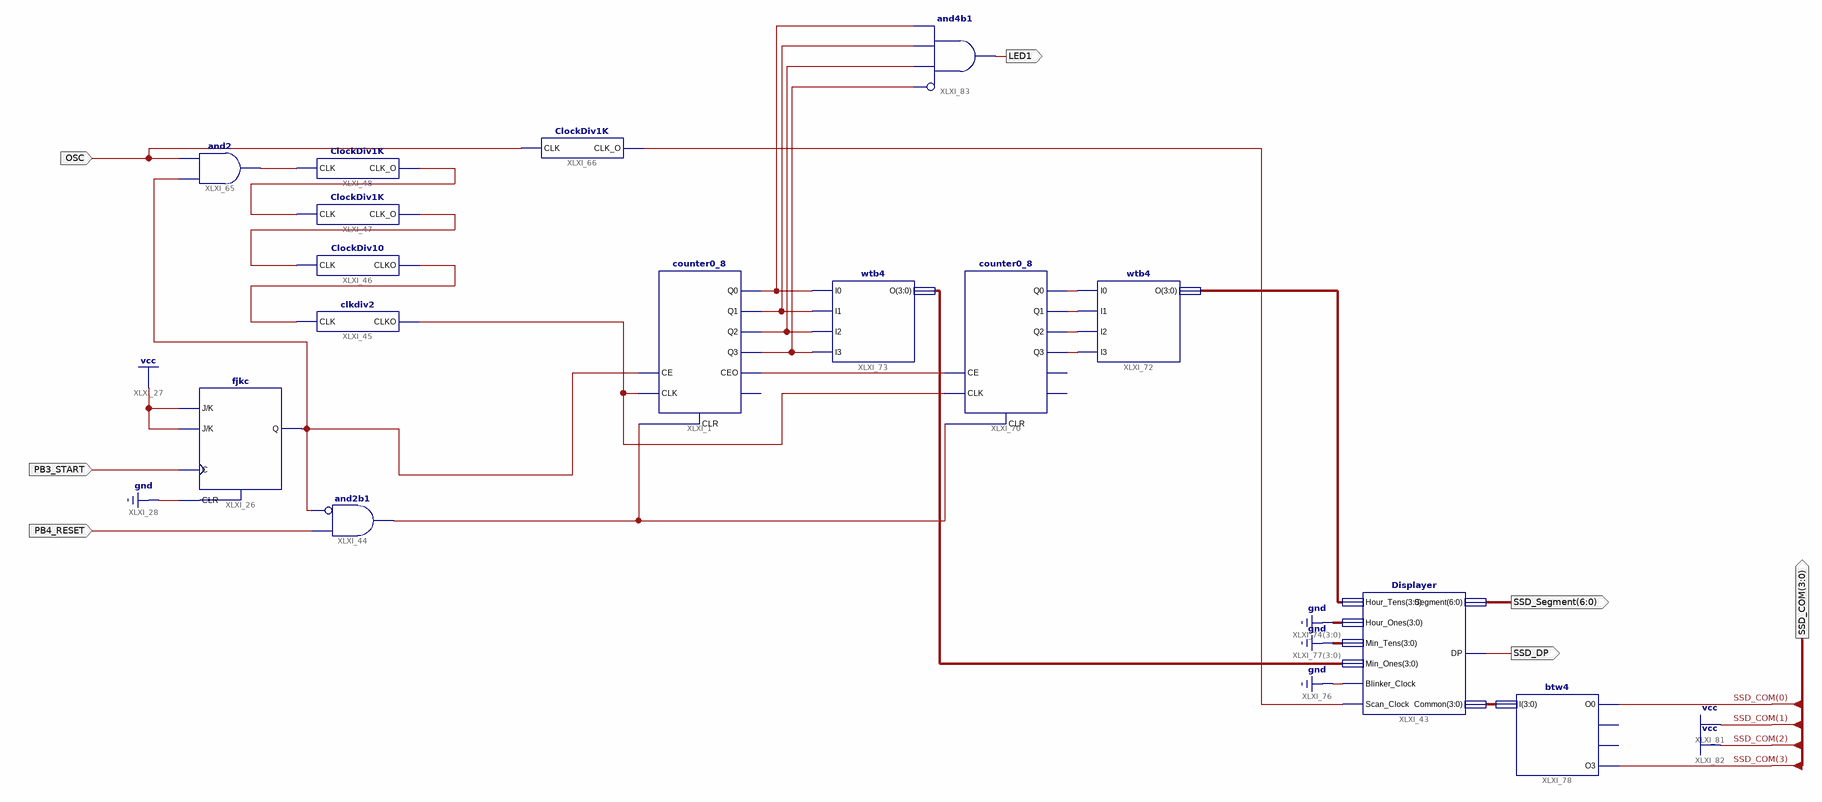
[diagram p0: schematic sheet 1]
// Xilinx ISE schematic mainer.sch (spartan6) as structural Verilog: 15 symbols, 7 ports
module mainer (
  input  PB3_START,
  input  PB4_RESET,
  input  OSC,
  output [6:0] SSD_Segment,
  output SSD_DP,
  output [3:0] SSD_COM,
  output LED1
);

  wire XLXN_42, XLXN_117, XLXN_10793, XLXN_10879, XLXN_10880, XLXN_10881, XLXN_10895, XLXN_10896, XLXN_10899,
       XLXN_10901, XLXN_10902, XLXN_10903, XLXN_10904, XLXN_10923, XLXN_10924, XLXN_10925, XLXN_10926;
  wire [3:0] XLXN_101, XLXN_10911, XLXN_10915;

  counter0_8 XLXI_1 (
    .CE(XLXN_10880), .CLK(XLXN_10895), .CLR(XLXN_10896), .CEO(XLXN_10899), .Q0(XLXN_10923), .Q1(XLXN_10924),
    .Q2(XLXN_10925), .Q3(XLXN_10926));  // open: TC
  fjkc XLXI_26 (.C(PB3_START), .CLR(1'b0), .J(1'b1), .K(1'b1), .Q(XLXN_10880));
  and XLXI_44 (XLXN_10896, ~XLXN_10880, PB4_RESET);  // and2b1
  clkdiv2 XLXI_45 (.CLK(XLXN_10793), .CLKO(XLXN_10895));
  ClockDiv10 XLXI_46 (.CLK(XLXN_42), .CLKO(XLXN_10793));
  ClockDiv1K XLXI_47 (.CLK(XLXN_117), .CLK_O(XLXN_42));
  ClockDiv1K XLXI_48 (.CLK(XLXN_10879), .CLK_O(XLXN_117));
  and XLXI_65 (XLXN_10879, XLXN_10880, OSC);
  ClockDiv1K XLXI_66 (.CLK(OSC), .CLK_O(XLXN_10881));
  Displayer XLXI_43 (
    .Hour_Tens(XLXN_101), .Hour_Ones(4'b0000), .Min_Tens(4'b0000), .Min_Ones(XLXN_10911),
    .Blinker_Clock(1'b0), .Scan_Clock(XLXN_10881), .Segment(SSD_Segment), .DP(SSD_DP), .Common(XLXN_10915));
  counter0_8 XLXI_70 (
    .CE(XLXN_10899), .CLK(XLXN_10895), .CLR(XLXN_10896), .Q0(XLXN_10901), .Q1(XLXN_10902), .Q2(XLXN_10903),
    .Q3(XLXN_10904));  // open: CEO, TC
  wtb4 XLXI_72 (.I0(XLXN_10901), .I1(XLXN_10902), .I2(XLXN_10903), .I3(XLXN_10904), .O(XLXN_101));
  wtb4 XLXI_73 (.I0(XLXN_10923), .I1(XLXN_10924), .I2(XLXN_10925), .I3(XLXN_10926), .O(XLXN_10911));
  btw4 XLXI_78 (.I(XLXN_10915), .O0(SSD_COM[0]), .O3(SSD_COM[3]));  // open: O1, O2
  and XLXI_83 (LED1, ~XLXN_10926, XLXN_10925, XLXN_10924, XLXN_10923);  // and4b1

  assign SSD_COM[2:1] = 2'b11;
endmodule
